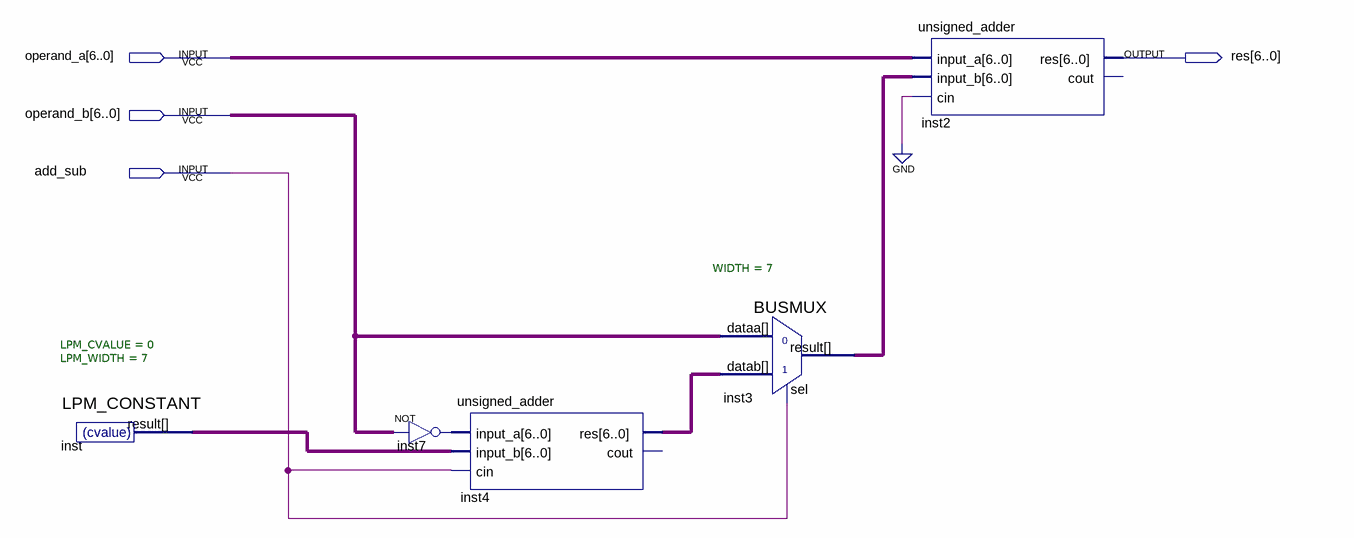
[diagram p0: schematic sheet]
// Quartus schematic add_sub.bdf as structural Verilog: 5 symbols, 4 pins
module add_sub (
  input  [6:0] operand_a,
  input  [6:0] operand_b,
  input  add_sub,
  output [6:0] res
);

  wire [6:0] inst3_result, inst4_res, inst7_out, inst_result;

  LPM_CONSTANT #(.LPM_CVALUE(0), .LPM_WIDTH(7)) inst (.result(inst_result));
  unsigned_adder inst4 (.input_a(inst7_out), .input_b(inst_result), .cin(add_sub), .res(inst4_res));  // open: cout
  assign inst7_out = ~operand_b;  // NOT inst7, 7 bits wide
  BUSMUX #(.WIDTH(7)) inst3 (.datab(inst4_res), .sel(add_sub), .dataa(operand_b), .result(inst3_result));
  unsigned_adder inst2 (.input_a(operand_a), .input_b(inst3_result), .cin(1'b0), .res(res));  // open: cout
endmodule
